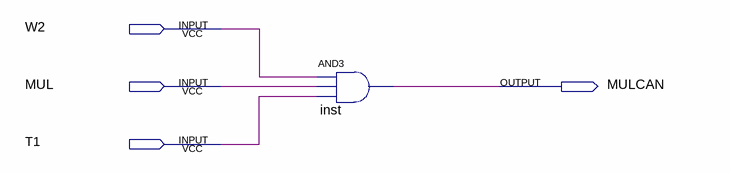
[diagram p0: schematic sheet]
// Quartus schematic MULCAN.bdf as structural Verilog: 1 symbols, 4 pins
module MULCAN (
  input  W2,
  input  MUL,
  input  T1,
  output MULCAN
);

  and inst (MULCAN, W2, MUL, T1);
endmodule
